# Altium schematic sheet Switching_Regulator_LV.SchDoc
size A3; Description: Sample Title Block; Version: 1.0
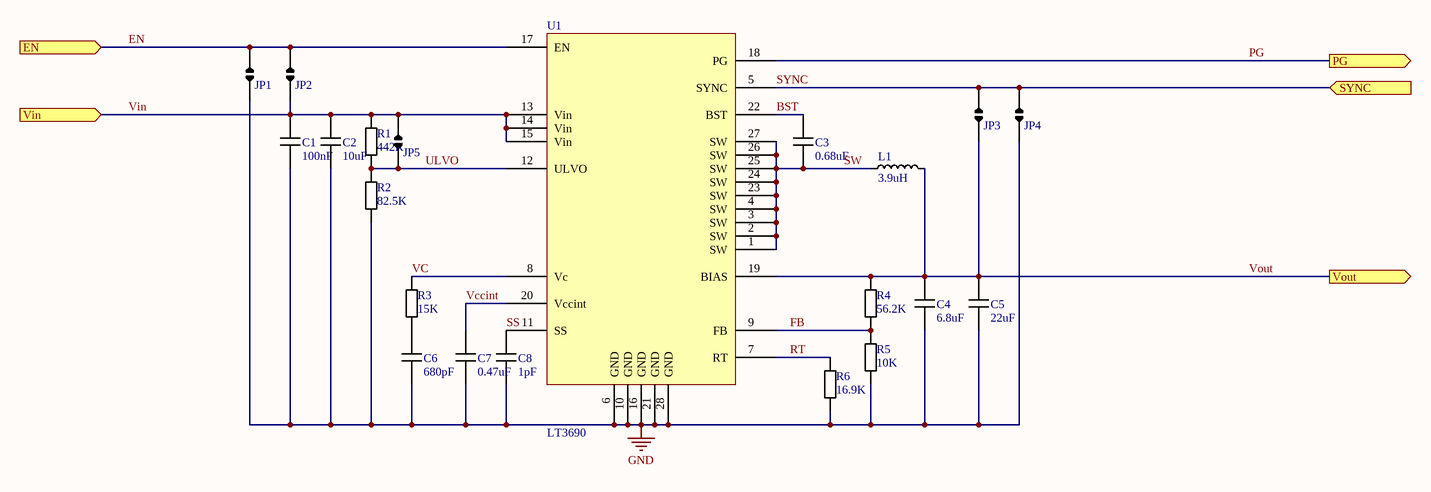
[diagram p0: Switching_Regulator_LV.SchDoc]

## Parts
C1  value 100nF  [0805 Cap]  (hidden comment: 0805 Cap)
C2  value 10uF  [1206 Cap]  (hidden comment: 1206 Cap)
C3  value 0.68uF  [0805 Cap]  (hidden comment: 0805 Cap)
C4  value 6.8uF  [0805 Cap]  (hidden comment: 0805 Cap)
C5  value 22uF  [1206 Cap]  (hidden comment: 1206 Cap)
C6  value 680pF  [0805 Cap]  (hidden comment: 0805 Cap)
C7  value 0.47uF  [0805 Cap]  (hidden comment: 0805 Cap)
C8  value 1pF  [0805 Cap]  (hidden comment: 0805 Cap)
JP1  Jumper  [Solder Jumper C]  (value not drawn)
JP2  Jumper  [Solder Jumper C]  (value not drawn)
JP3  Jumper  [Solder Jumper C]  (value not drawn)
JP4  Jumper  [Solder Jumper C]  (value not drawn)
JP5  Jumper  [Solder Jumper C]  (value not drawn)
L1  value 3.9uH  [INDP4037X16N]  (hidden comment: LQH44PN2R2MP0)
R1  value 442K  [0805 Resistor]  (hidden comment: 0805 Resistor)
R2  value 82.5K  [0805 Resistor]  (hidden comment: 0805 Resistor)
R3  value 15K  [0805 Resistor]  (hidden comment: 0805 Resistor)
R4  value 56.2K  [0805 Resistor]  (hidden comment: 0805 Resistor)
R5  value 10K  [0805 Resistor]  (hidden comment: 0805 Resistor)
R6  value 16.9K  [0805 Resistor]  (hidden comment: 0805 Resistor)
U1  LT3690  [LT3690]

## Ports
EN (in), PG (out), SYNC (in), Vin (in), Vout (out)

## Nets
GND: C1.1 C2.1 C4.1 C5.1 C6.1 C7.1 C8.1 JP1.2 JP4.2 R2.1 R5.1 R6.1 U1.6(GND) U1.10(GND) U1.16(GND) U1.21(GND) U1.28(GND)
BST: C3.2 U1.22(BST)
EN: JP1.1 JP2.1 U1.17(EN) ; port EN
FB: R4.1 R5.2 U1.9(FB)
PG: U1.18(PG) ; port PG
RT: R6.2 U1.7(RT)
SS: C8.2 U1.11(SS)
SW: C3.1 L1.1 U1.1(SW) U1.2(SW) U1.3(SW) U1.4(SW) U1.23(SW) U1.24(SW) U1.25(SW) U1.26(SW) U1.27(SW)
SYNC: JP3.1 JP4.1 U1.5(SYNC) ; port SYNC
ULVO: JP5.2 R1.1 R2.2 U1.12(ULVO)
VC: R3.2 U1.8(Vc)
Vccint: C7.2 U1.20(Vccint)
Vin: C1.2 C2.2 JP2.2 JP5.1 R1.2 U1.13(Vin) U1.14(Vin) U1.15(Vin) ; port Vin
Vout: C4.2 C5.2 JP3.2 L1.2 R4.2 U1.19(BIAS) ; port Vout
NetC6_2: C6.2 R3.1

## Notes on the sheet
- Title
- Description:
- Size:
- Author:
- Date:
- A3
- Time:
- Version
- Sheet:
- Drawing No.:
- of
- File:

## Library data of the parts
C1 C3 C4 C7 = 0805 MLCC - X7R, 10%
C2 C5 = 1206 MLCC - X7R, 10%
C6 C8 = 0805 MLCC - NP0, 5%
JP1-JP5 = Solder Bridge
L1 = LQH44PN2R2MP0: Inductor 4x4mm 2.2uH; ComponentLink1Description: Datasheet; ComponentLink1URL: http://search.murata.co.jp/Ceramy/image/img/PDF/ENG/L0075S0103LQH44P.pdf
R1-R6 = 0805 Thick Film Resistor 1%